# Altium schematic sheet 02_Power.SchDoc
size A4; Author: Ganghyeok Lim; Revision: B; SheetNumber: 3; SheetTotal: 7
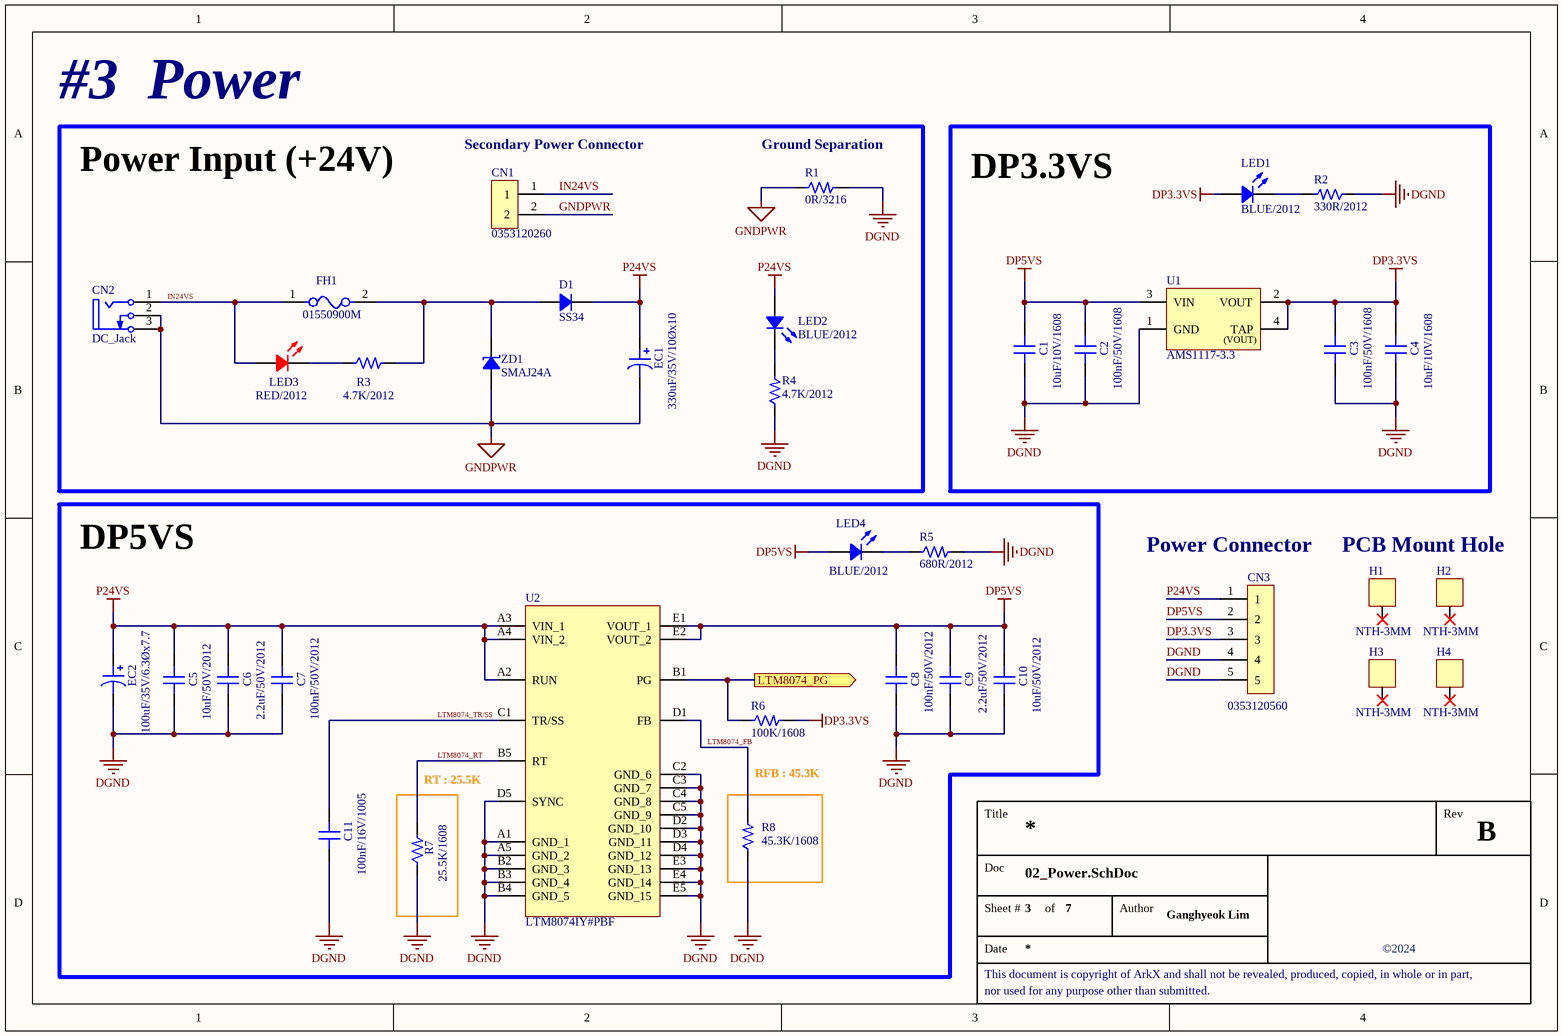
[diagram p0: 02_Power.SchDoc]

## Parts
C1  10uF/10V/1608  [CAP 1608 (0603_INCH)]
C2  100nF/50V/1608  [CAP 1608 (0603_INCH)]
C3  100nF/50V/1608  [CAP 1608 (0603_INCH)]
C4  10uF/10V/1608  [CAP 1608 (0603_INCH)]
C5  10uF/50V/2012  [CAP 2012 (0805_INCH)]
C6  2.2uF/50V/2012  [CAP 2012 (0805_INCH)]
C7  100nF/50V/2012  [CAP 2012 (0805_INCH)]
C8  100nF/50V/2012  [CAP 2012 (0805_INCH)]
C9  2.2uF/50V/2012  [CAP 2012 (0805_INCH)]
C10  10uF/50V/2012  [CAP 2012 (0805_INCH)]
C11  100nF/16V/1005  [CAP 1005 (0402_INCH)]
CN1  0353120260  [CON 0353120260 (MOLEX)]
CN2  DC_Jack  [CON DC-Jack]
CN3  0353120560  [CON 0353120560 (MOLEX)]
D1  SS34  [DIO DO-214AC (SMA)]
EC1  330uF/35V/10Øx10  [CAP ALSMD 10.3MM H10.5MM LEADSPANMAX12MM]
EC2  100uF/35V/6.3Øx7.7  [CAP ALSMD 6.6MM H7.7MM]
FH1  01550900M  [FUSE 01550900M_SMD(Hand_Solder)]
H1  NTH-3MM  [HOLE NTH-3MM]
H2  NTH-3MM  [HOLE NTH-3MM]
H3  NTH-3MM  [HOLE NTH-3MM]
H4  NTH-3MM  [HOLE NTH-3MM]
LED1  BLUE/2012  [LED MHT170RGBCT (BLUE)]
LED2  BLUE/2012  [LED MHT170RGBCT (BLUE)]
LED3  RED/2012  [LED MHT170RGBCT (RED)]
LED4  BLUE/2012  [LED MHT170RGBCT (BLUE)]
R1  0R/3216  [RES 3216 (1206_inch)]
R2  330R/2012  [RES 2012 (0805_inch)]
R3  4.7K/2012  [RES 2012 (0805_inch)]
R4  4.7K/2012  [RES 2012 (0805_inch)]
R5  680R/2012  [RES 2012 (0805_inch)]
R6  100K/1608  [RES 1608 (0603_inch)]
R7  25.5K/1608  [RES 1608 (0603_inch)]
R8  45.3K/1608  [RES 1608 (0603_inch)]
U1  AMS1117-3.3  [SOT 223-3 (DIODES INCORPORATED)]
U2  LTM8074IY#PBF  [IC_BGA-25]
ZD1  SMAJ24A  [DIO DO-214AC (SMA)]

## Blocks framed on the sheet
#3  Power: CN1 CN2 D1 EC1 FH1 LED2 LED3 R1 R3 R4 ZD1
DP3.3VS: C1-C4 LED1 R2 U1
DP5VS: C5-C11 EC2 LED4 R5 R6 U2
RT : 25.5K: R7
RFB : 45.3K: R8

## Ports
LTM8074_PG (out)

## Nets
DGND: C1.1 C2.1 C3.1 C4.1 C5.1 C6.1 C7.1 C8.1 C9.1 C10.1 C11.1 CN3.4 CN3.5 EC2.2 R1.2 R2.1 R4.1 R5.2 R7.1 R8.1 U1.1(GND) U2.A1(GND_1) U2.A5(GND_2) U2.B2(GND_3) U2.B3(GND_4) U2.B4(GND_5) U2.C2(GND_6) U2.C3(GND_7) U2.C4(GND_8) U2.C5(GND_9) U2.D2(GND_10) U2.D3(GND_11) U2.D4(GND_12) U2.D5(SYNC) U2.E3(GND_13) U2.E4(GND_14) U2.E5(GND_15)
DP3.3VS: C3.2 C4.2 CN3.3 LED1.4(Common_Anode) R6.2 U1.2(VOUT) U1.4(TAP)
DP5VS: C1.2 C2.2 C8.2 C9.2 C10.2 CN3.2 LED4.4(Common_Anode) U1.3(VIN) U2.E1(VOUT_1) U2.E2(VOUT_2)
GNDPWR: CN1.2 CN2.2(GND) CN2.3(GND) EC1.2 R1.1 ZD1.1
P24VS: C5.2 C6.2 C7.2 CN3.1 D1.2 EC1.1 EC2.1 LED2.4(Common_Anode) U2.A2(RUN) U2.A3(VIN_1) U2.A4(VIN_2)
IN24VS: CN1.1 CN2.1(VCC) FH1.1 LED3.4(Common_Anode)
LTM8074_FB: R8.2 U2.D1(FB)
LTM8074_PG: R6.1 U2.B1(PG) ; port LTM8074_PG
LTM8074_RT: R7.2 U2.B5(RT)
LTM8074_TR/SS: C11.2 U2.C1(TR/SS)
NetD1_1: D1.1 FH1.2 R3.2 ZD1.2
NetLED1_3: LED1.3(BLUE) R2.2
NetLED2_3: LED2.3(BLUE) R4.2
NetLED3_1: LED3.1(RED) R3.1
NetLED4_3: LED4.3(BLUE) R5.1

Not connected (* = marked no-connect by the designer): H1 1*; H2 1*; H3 1*; H4 1*

## Notes on the sheet
- Power Input (+24V)
- (near CN1) Secondary Power Connector
- (near R1) Ground Separation
- (near CN3) Power Connector
- PCB Mount Hole
- Title
- Rev
- Doc
- Sheet #
- of
- Author
- This document is copyright of ArkX and shall not be revealed, produced, copied, in whole or in part,
- Date
- ©2024
- nor used for any purpose other than submitted.
- (in symbol IC_REG_AMS1117-3.3) (VOUT)

## Library data of the parts
C1 C4 = CAP_10uF/10V/1608: Ceramic CAP_10uF/10V/1608; LCSC Part #: C19702; JLCPCB Part Type: Basic Part
C2 C3 = CAP_100nF/50V/1608: Ceramic CAP_100nF/50V/1608; LCSC Part #: C14663; JLCPCB Part Type: Basic Part
C5 C10 = CAP_10uF/50V/2012: Ceramic CAP_10uF/50V/2012; LCSC Part #: C440198; JLCPCB Part Type: Basic Part
C6 C9 = CAP_2.2uF/50V/2012: Ceramic CAP_2.2uF/50V/2012; LCSC Part #: C49217; JLCPCB Part Type: Basic Part
C7 C8 = CAP_100nF/50V/2012: Ceramic CAP_100nF/50V/2012; LCSC Part #: C49678; JLCPCB Part Type: Basic Part
C11 = CAP_100nF/16V/1005: Ceramic CAP_100nF/16V/1005; LCSC Part #: C1525; JLCPCB Part Type: Basic Part
CN1 = CON_0353120260: CONN HEADER VERT 2POS 2.5MM
CN2 = CON_DC-Jack: ComponentLink1Description: Manufacturer Link; ComponentLink1URL: http://www.cliffuk.co.uk/
CN3 = CON_0353120560: CONN HEADER VERT 5POS 2.5MM
D1 = DIO_SS34: DIODE SCHOTTKY 40V 3A SMC; LCSC Part #: C8678; JLCPCB Part Type: Basic Part
EC1 = CAP_EC 330uF/35V/10Øx10: Electrolytic CAP_330uF/35V/10Øx10; LCSC Part #: C311621; JLCPCB Part Type: Extended Part
EC2 = CAP_EC 100uF/35V/6.3Øx7.7: Eletrolytic CAP_100uF/35V/6.3Øx7.7; LCSC Part #: C176666; JLCPCB Part Type: Extended Part
FH1 = FUSE_01550900M-SMD: Fuse Block 10A 125V 1 Circuit Cartridge Surface Mount; LCSC Part #: C108518; JLCPCB Part Type: Extended Part
H1-H4 = HOLE_NTH-3MM: Non-Through Hole 3mm
LED1 LED2 LED4 = LED_MHT170RGBCT(BLUE): Colorless transparence -30℃~+85℃ Positive post Common anode RGB 120° 0805  Light Emitting Diodes (LED) ROHS; LCSC Part #: C2962094; JLCPCB Part Type: Extended Part
LED3 = LED_MHT170RGBCT(RED): Colorless transparence -30℃~+85℃ Positive post Common anode RGB 120° 0805  Light Emitting Diodes (LED) ROHS; LCSC Part #: C2962094; JLCPCB Part Type: Extended Part
R1 = RES_0R/3216/0.25W: Power Rating: 0.1W; Precision: 1%; Size: 1608; LCSC Part #: C17888; JLCPCB Part Type: Basic Part
R2 = RES_330R/2012/0.125W: Value: 330R; Power Rating: 0.125W; Precision: 1%; Size: 2012; LCSC Part #: C17630; JLCPCB Part Type: Basic Part
R3 R4 = RES_4.7K/2012/0.125W: Value: 4.7K; Power Rating: 0.125W; Precision: 1%; Size: 2012; LCSC Part #: C17673; JLCPCB Part Type: Basic Part
R5 = RES_680R/2012/0.125W: Value: 680R; Power Rating: 0.125W; Precision: 1%; Size: 2012; LCSC Part #: C17798; JLCPCB Part Type: Basic Part
R6 = RES_100K/1608/0.1W: Value: 100K; Power Rating: 0.1W; Precision: 1%; Size: 1608; LCSC Part #: C25803; JLCPCB Part Type: Basic Part
R7 = RES_25.5K/1608/0.1W: Value: 25.5K; Power Rating: 0.1W; Precision: 1%; Size: 1608; LCSC Part #: C321813; JLCPCB Part Type: Extended Part
R8 = RES_45.3K/1608/0.1W: Value: 45.3K; Power Rating: 0.1W; Precision: 1%; Size: 1608; LCSC Part #: C304756; JLCPCB Part Type: Extended Part
U1 = IC_REG_AMS1117-3.3: 72dB@(120Hz) 1A 1.3V@(800mA) Fixed 3.3V~3.3V Positive 1 SOT-223  Linear Voltage Regulators (LDO) ROHS; LCSC Part #: C6186; JLCPCB Part Type: Basic Part
U2 = IC_REG_LTM8074IY#PBF: 1.2A, 40V DC/DC Buck Module Reg; LCSC Part #: C690772; JLCPCB Part Type: Extended Part
ZD1 = DIO_SMAJ24A: Rectifier Diode; LCSC Part #: C113962; JLCPCB Part Type: Extended Part